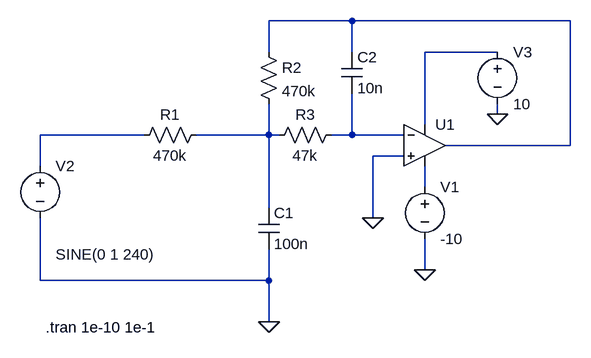
[diagram p0: schematic circuito_ii_pratica_3 - Copia.asc]
circuito_ii_pratica_3 - Copia.asc, the LTspice schematic file:
Version 4
SHEET 1 920 680
WIRE 560 -144 432 -144
WIRE 896 -144 560 -144
WIRE 432 -96 432 -144
WIRE 560 -96 560 -144
WIRE 784 -96 672 -96
WIRE 784 0 784 -16
WIRE 672 16 672 -96
WIRE 240 32 80 32
WIRE 432 32 432 -16
WIRE 432 32 320 32
WIRE 448 32 432 32
WIRE 560 32 560 -32
WIRE 560 32 528 32
WIRE 640 32 560 32
WIRE 896 48 896 -144
WIRE 896 48 704 48
WIRE 640 64 592 64
WIRE 80 80 80 32
WIRE 672 112 672 80
WIRE 432 144 432 32
WIRE 592 160 592 64
WIRE 672 240 672 192
WIRE 80 256 80 160
WIRE 432 256 432 208
WIRE 432 256 80 256
WIRE 432 320 432 256
FLAG 432 320 0
FLAG 784 0 0
FLAG 672 240 0
FLAG 592 160 0
SYMBOL voltage 672 96 R0
SYMATTR InstName V1
SYMATTR Value -10
SYMBOL OpAmps\\UniversalOpAmp 672 48 R0
SYMATTR InstName U1
SYMBOL voltage 784 -112 R0
SYMATTR InstName V3
SYMATTR Value 10
SYMBOL res 336 16 R90
WINDOW 0 0 56 VBottom 2
WINDOW 3 32 56 VTop 2
SYMATTR InstName R1
SYMATTR Value 470k
SYMBOL voltage 80 64 R0
WINDOW 123 24 124 Left 2
WINDOW 39 0 0 Left 0
WINDOW 3 24 152 Left 2
SYMATTR Value SINE(0 1 240)
SYMATTR InstName V2
SYMBOL cap 416 144 R0
SYMATTR InstName C1
SYMATTR Value 100n
SYMBOL cap 544 -96 R0
SYMATTR InstName C2
SYMATTR Value 10n
SYMBOL res 416 -112 R0
SYMATTR InstName R2
SYMATTR Value 470k
SYMBOL res 544 16 R90
WINDOW 0 0 56 VBottom 2
WINDOW 3 32 56 VTop 2
SYMATTR InstName R3
SYMATTR Value 47k
TEXT 88 328 Left 2 !.tran 1e-10 1e-1

The netlist it stands for:
* circuito_ii_pratica_3 - Copia.asc
V1 N006 0 -10
XU1 0 N005 N002 N006 N001 level1 Avol=1Meg GBW=10Meg Vos=0 En=0 Enk=0 In=0 Ink=0 Rin=500Meg  ; pins In+ In- V+ V- OUT
V3 N002 0 10
R1 N004 N003 470k
V2 N003 0 SINE(0 1 240)
C1 N004 0 100n
C2 N001 N005 10n
R2 N001 N004 470k
R3 N005 N004 47k
.tran 1e-10 1e-1
.lib UniversalOpAmp1.lib
.backanno
.end